# Altium schematic sheet 04 - Auxiliary Power.SchDoc: Auxiliary Power - 25kW WolfPACK FM3 Six-Pack Inv. (part 1 of 3)
size 431 x 279 mm; Date: 07/2023; DocumentNumber: CRD25DA12N-FMC; Revision: 1.1; SheetNumber: 4; SheetTotal: 8; SheetSize: B
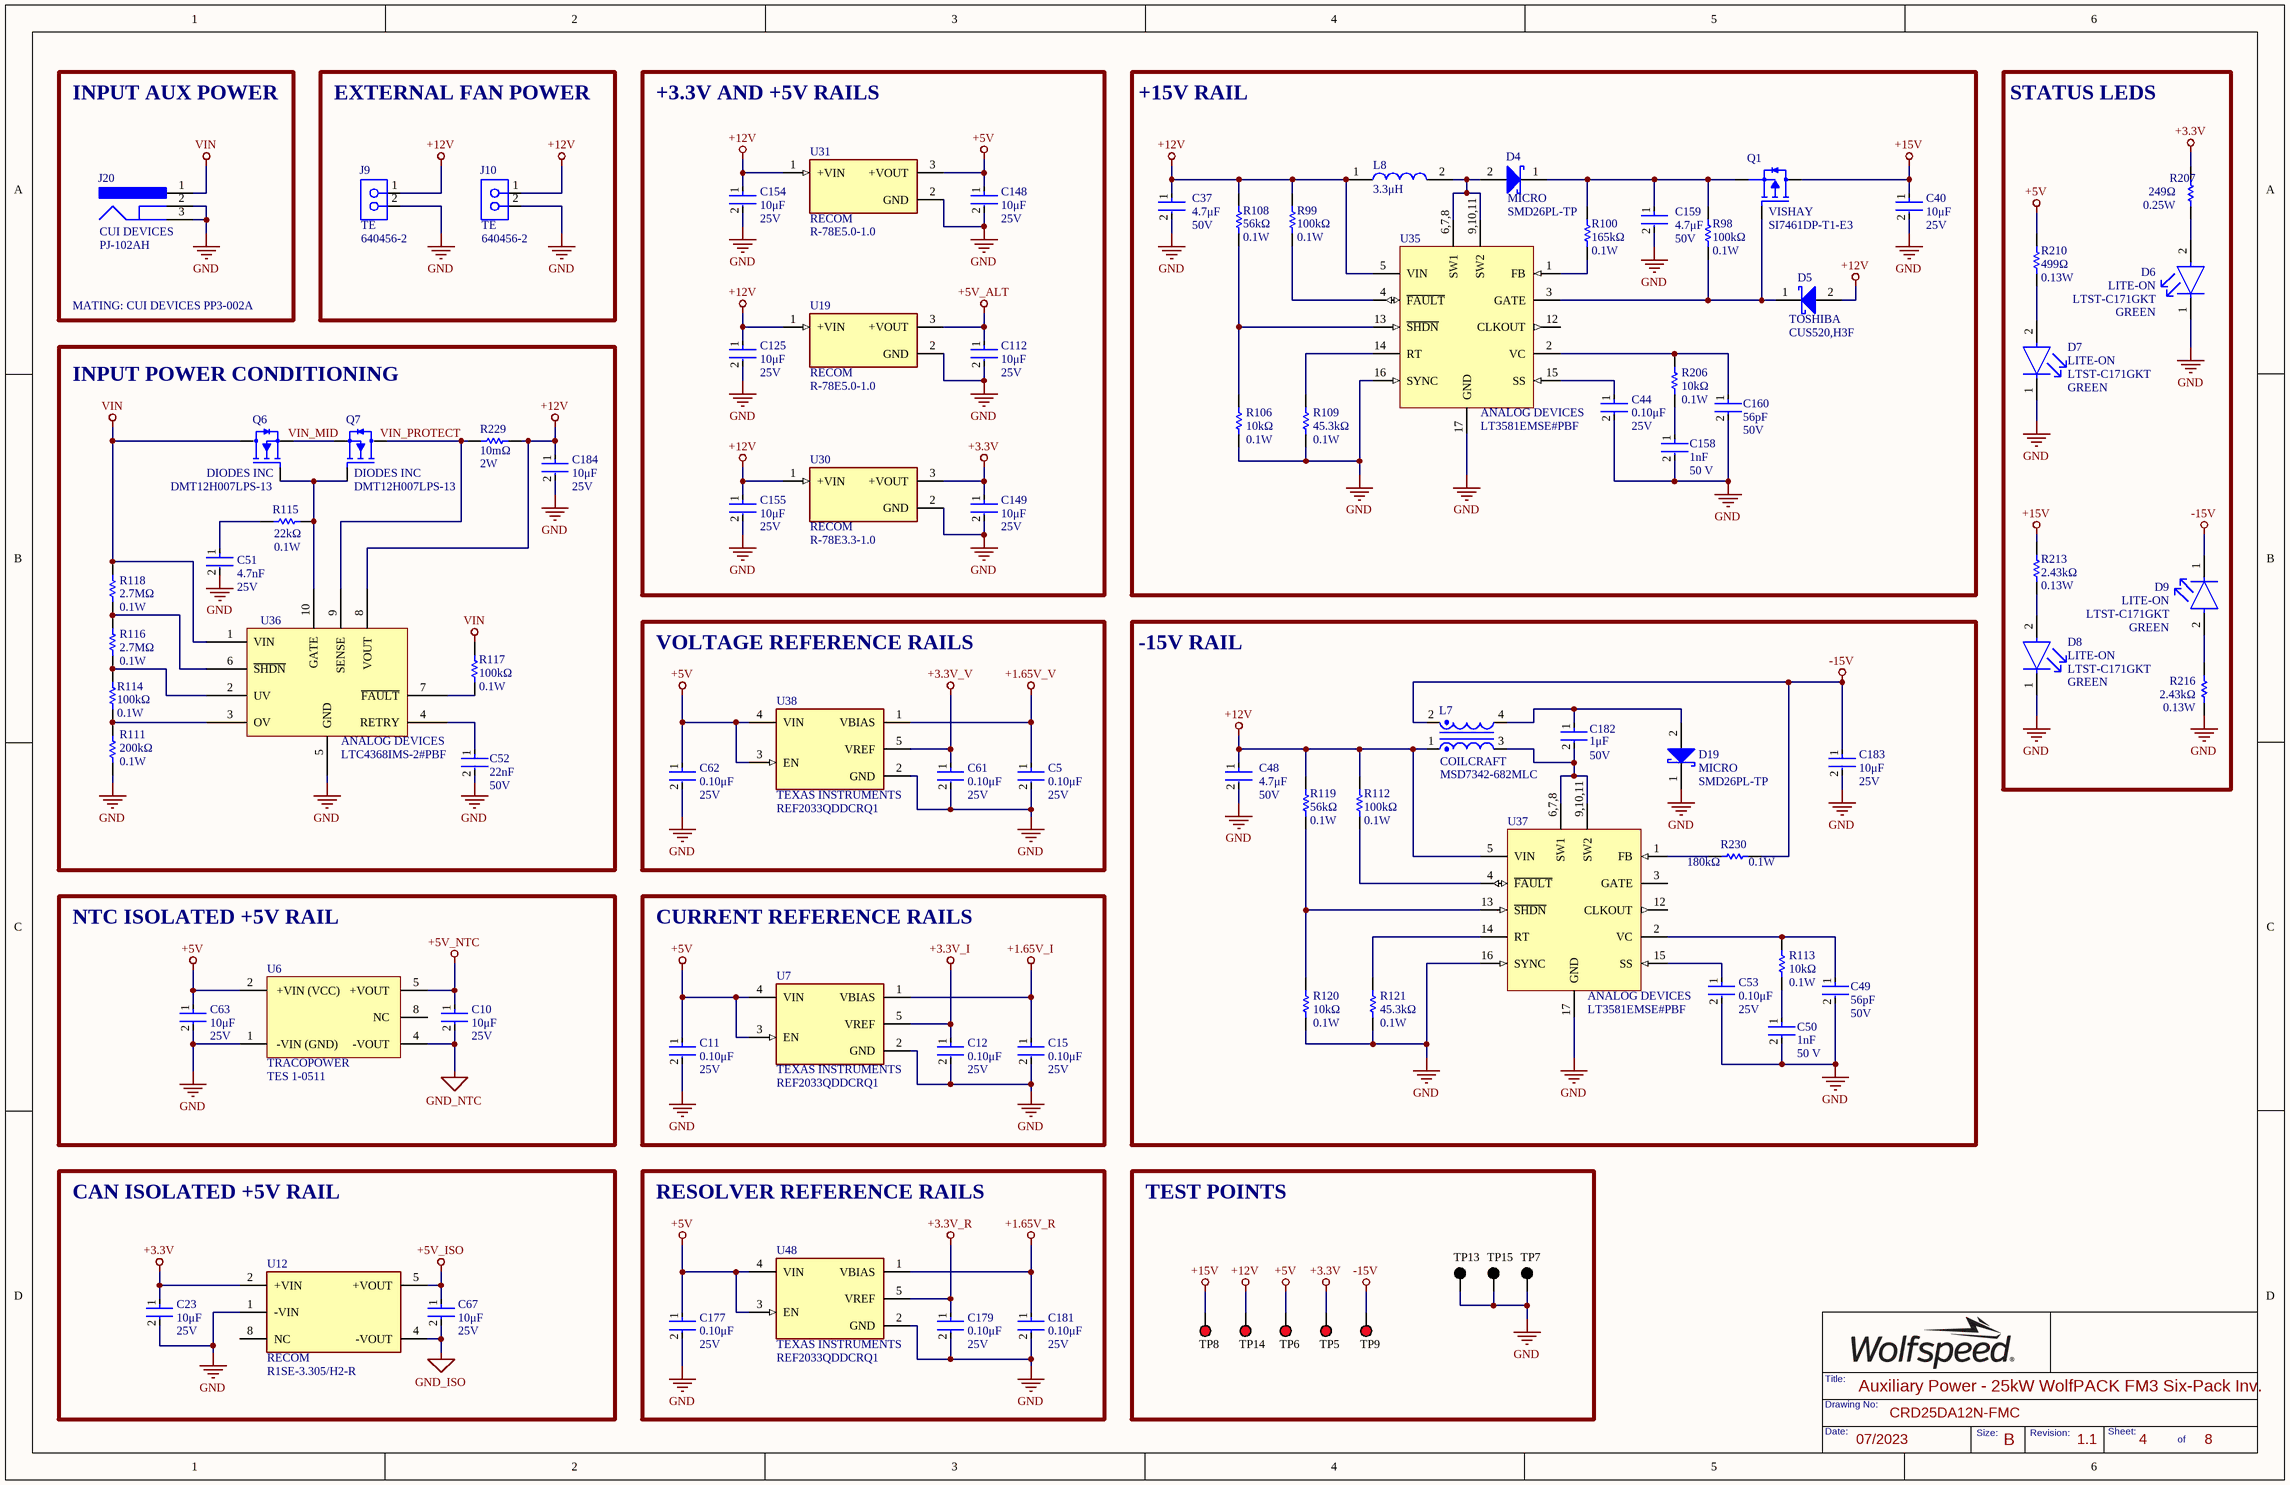
[diagram p0: 04 - Auxiliary Power.SchDoc]

## Parts
C5  Voltage Rating: 25V  Capacitance: 0.10μF  [FP-C0603C-CF-IPC_B]  (hidden comment: C0603C104K3RACTU)
C10  Voltage Rating: 25V  Capacitance: 10μF  [FP-CL31-IPC_B]  (hidden comment: CL31B106KAHSFNE)
C11  Voltage Rating: 25V  Capacitance: 0.10μF  [FP-C0603C-CF-IPC_B]  (hidden comment: C0603C104K3RACTU)
C12  Voltage Rating: 25V  Capacitance: 0.10μF  [FP-C0603C-CF-IPC_B]  (hidden comment: C0603C104K3RACTU)
C15  Voltage Rating: 25V  Capacitance: 0.10μF  [FP-C0603C-CF-IPC_B]  (hidden comment: C0603C104K3RACTU)
C23  Voltage Rating: 25V  Capacitance: 10μF  [FP-CL31-IPC_B]  (hidden comment: CL31B106KAHSFNE)
C37  Voltage Rating: 50V  Capacitance: 4.7μF  [FP-CL31-IPC_C]  (hidden comment: CL31B475KBHNFNE)
C40  Voltage Rating: 25V  Capacitance: 10μF  [FP-CL31-IPC_B]  (hidden comment: CL31B106KAHSFNE)
C44  Voltage Rating: 25V  Capacitance: 0.10μF  [FP-C0603C-CF-IPC_B]  (hidden comment: C0603C104K3RACTU)
C48  Voltage Rating: 50V  Capacitance: 4.7μF  [FP-CL31-IPC_C]  (hidden comment: CL31B475KBHNFNE)
C49  Capacitance: 56pF  Voltage Rating: 50V  [FP-C0603C-CF-IPC_B]  (hidden comment: CL10C560JB8NNNC)
C50  Capacitance: 1nF  Voltage Rating: 50 V  [FP-C0603C-CF-IPC_B]  (hidden comment: C0603C102K5RACAUTO)
C51  Voltage Rating: 25V  Capacitance: 4.7nF  [FP-C0603C-CF-IPC_B]  (hidden comment: C0603C472K3RAC7867)
C52  Capacitance: 22nF  Voltage: 50V  [FP-C0603C-CF-IPC_B]  (hidden comment: CC0805KRX7R9BB223)
C53  Voltage Rating: 25V  Capacitance: 0.10μF  [FP-C0603C-CF-IPC_B]  (hidden comment: C0603C104K3RACTU)
C61  Voltage Rating: 25V  Capacitance: 0.10μF  [FP-C0603C-CF-IPC_B]  (hidden comment: C0603C104K3RACTU)
C62  Voltage Rating: 25V  Capacitance: 0.10μF  [FP-C0603C-CF-IPC_B]  (hidden comment: C0603C104K3RACTU)
C63  Voltage Rating: 25V  Capacitance: 10μF  [FP-CL31-IPC_B]  (hidden comment: CL31B106KAHSFNE)
C67  Voltage Rating: 25V  Capacitance: 10μF  [FP-CL31-IPC_B]  (hidden comment: CL31B106KAHSFNE)
C112  Voltage Rating: 25V  Capacitance: 10μF  [FP-CL31-IPC_B]  (hidden comment: CL31B106KAHSFNE)
C125  Voltage Rating: 25V  Capacitance: 10μF  [FP-CL31-IPC_B]  (hidden comment: CL31B106KAHSFNE)
C148  Voltage Rating: 25V  Capacitance: 10μF  [FP-CL31-IPC_B]  (hidden comment: CL31B106KAHSFNE)
C149  Voltage Rating: 25V  Capacitance: 10μF  [FP-CL31-IPC_B]  (hidden comment: CL31B106KAHSFNE)
C154  Voltage Rating: 25V  Capacitance: 10μF  [FP-CL31-IPC_B]  (hidden comment: CL31B106KAHSFNE)
C155  Voltage Rating: 25V  Capacitance: 10μF  [FP-CL31-IPC_B]  (hidden comment: CL31B106KAHSFNE)
C158  Capacitance: 1nF  Voltage Rating: 50 V  [FP-C0603C-CF-IPC_B]  (hidden comment: C0603C102K5RACAUTO)
C159  Voltage Rating: 50V  Capacitance: 4.7μF  [FP-CL31-IPC_C]  (hidden comment: CL31B475KBHNFNE)
C160  Capacitance: 56pF  Voltage Rating: 50V  [FP-C0603C-CF-IPC_B]  (hidden comment: CL10C560JB8NNNC)
C177  Voltage Rating: 25V  Capacitance: 0.10μF  [FP-C0603C-CF-IPC_B]  (hidden comment: C0603C104K3RACTU)
C179  Voltage Rating: 25V  Capacitance: 0.10μF  [FP-C0603C-CF-IPC_B]  (hidden comment: C0603C104K3RACTU)
C181  Voltage Rating: 25V  Capacitance: 0.10μF  [FP-C0603C-CF-IPC_B]  (hidden comment: C0603C104K3RACTU)
C182  Capacitance: 1μF  Voltage: 50V  [FP-CL21-IPC_A]  (hidden comment: CL21B105KBFNNNE)
C183  Voltage Rating: 25V  Capacitance: 10μF  [FP-CL31-IPC_B]  (hidden comment: CL31B106KAHSFNE)
C184  Voltage Rating: 25V  Capacitance: 10μF  [FP-CL31-IPC_B]  (hidden comment: CL31B106KAHSFNE)
D4  SMD26PL-TP  Manufacturer Print: MICRO  [ONSC-SOD-123FL-2-498-01_V]
D5  CUS520,H3F  Manufacturer Print: TOSHIBA  [FP-USC-MFG]
D6  value GREEN  Manufacturer: LITE-ON  [FP-LTST-C171GKT-MFG]  (hidden comment: LTST-C171GKT)
D7  value GREEN  Manufacturer: LITE-ON  [FP-LTST-C171GKT-MFG]  (hidden comment: LTST-C171GKT)
D8  value GREEN  Manufacturer: LITE-ON  [FP-LTST-C171GKT-MFG]  (hidden comment: LTST-C171GKT)
D9  value GREEN  Manufacturer: LITE-ON  [FP-LTST-C171GKT-MFG]  (hidden comment: LTST-C171GKT)
D19  SMD26PL-TP  Manufacturer Print: MICRO  [ONSC-SOD-123FL-2-498-01_V]
J9  640456-2  Manufacturer Print: TE  [TECO-640456-2_V]
J10  640456-2  Manufacturer Print: TE  [TECO-640456-2_V]
J20  PJ-102AH  Manufacturer Print: CUI DEVICES  [CUI-PJ-102B_V]
L7  MSD7342-682MLC  Manfacturer Print: COILCRAFT  [MSD7342682MLC]
L8  value 3.3μH  [FP-NR5040-H_4_1-MFG]  (hidden comment: NRS5040T3R3NMGJ)
Q1  Manufacturer: VISHAY  [FP-S17-0173-SINGLE-MFG]  (hidden comment: SI7461DP-T1-E3)
Q6  DMT12H007LPS-13  Manufacturer: DIODES INC  [FP-PowerDI5060-8-MFG]
Q7  DMT12H007LPS-13  Manufacturer: DIODES INC  [FP-PowerDI5060-8-MFG]
R98  Resistance: 100kΩ  Power Rating: 0.1W  [FP-MCR03-IPC_B]  (hidden comment: RC0603FR-07100KL)
R99  Resistance: 100kΩ  Power Rating: 0.1W  [FP-MCR03-IPC_B]  (hidden comment: RC0603FR-07100KL)
R100  Resistance: 165kΩ  Power Rating: 0.1W  [FP-MCR03-IPC_B]  (hidden comment: ERJ-3EKF1653V)
R106  Resistance: 10kΩ  Max Power Dissipation: 0.1W  [FP-MCR03-IPC_B]  (hidden comment: ERJ3EKF1002V)
R108  Resistance: 56kΩ  Power Rating: 0.1W  [FP-MCR03-IPC_B]  (hidden comment: RC0603FR-0756KL)
R109  Max Power Dissipation: 0.1W  Resistance: 45.3kΩ  [FP-MCR03-IPC_B]  (hidden comment: RMCF0603FT45K3)
R111  Resistance: 200kΩ  Max Power Dissipation: 0.1W  [FP-MCR03-IPC_B]  (hidden comment: ERJ-3EKF2003V)
R112  Resistance: 100kΩ  Power Rating: 0.1W  [FP-MCR03-IPC_B]  (hidden comment: RC0603FR-07100KL)
R113  Resistance: 10kΩ  Max Power Dissipation: 0.1W  [FP-MCR03-IPC_B]  (hidden comment: ERJ3EKF1002V)
R114  Resistance: 100kΩ  Power Rating: 0.1W  [FP-MCR03-IPC_B]  (hidden comment: RC0603FR-07100KL)
R115  Power Rating: 0.1W  Resistance: 22kΩ  [FP-MCR03-IPC_B]  (hidden comment: ERJ-3EKF2202V)
R116  Power Rating: 0.1W  Resistance: 2.7MΩ  [FP-MCR03-IPC_B]  (hidden comment: RC0603JR-072M7L)
R117  Resistance: 100kΩ  Power Rating: 0.1W  [FP-MCR03-IPC_B]  (hidden comment: RC0603FR-07100KL)
R118  Power Rating: 0.1W  Resistance: 2.7MΩ  [FP-MCR03-IPC_B]  (hidden comment: RC0603JR-072M7L)
R119  Resistance: 56kΩ  Power Rating: 0.1W  [FP-MCR03-IPC_B]  (hidden comment: RC0603FR-0756KL)
R120  Resistance: 10kΩ  Max Power Dissipation: 0.1W  [FP-MCR03-IPC_B]  (hidden comment: ERJ3EKF1002V)
R121  Max Power Dissipation: 0.1W  Resistance: 45.3kΩ  [FP-MCR03-IPC_B]  (hidden comment: RMCF0603FT45K3)
R206  Resistance: 10kΩ  Max Power Dissipation: 0.1W  [FP-MCR03-IPC_B]  (hidden comment: ERJ3EKF1002V)
R207  Resistance: 249Ω  Power Rating: 0.25W  [FP-MCR18-IPC_A]  (hidden comment: RC1206FR-07249RL)
R210  Resistance: 499Ω  Max Power Dissipation: 0.13W  [FP-MCR10-IPC_A]  (hidden comment: RC0805FR-07499RL)
R213  Resistance: 2.43kΩ  Power Rating: 0.13W  [FP-MCR10-IPC_A]  (hidden comment: ERJ-6ENF2431V)
R216  Resistance: 2.43kΩ  Power Rating: 0.13W  [FP-MCR10-IPC_A]  (hidden comment: ERJ-6ENF2431V)
R229  Resistance: 10mΩ  Max Power Dissipation: 2W  [FP-RL2512-IPC_A]  (hidden comment: PE2512FKE7W0R01L)
R230  Resistance: 180kΩ  Max Power Dissipation: 0.1W  [FP-CRGCQ0603-IPC_A]  (hidden comment: CRGCQ0603F180K)
TP5  5010  [KSTN-5010_V]  (value not drawn)
TP6  5010  [KSTN-5010_V]  (value not drawn)
TP7  5011  [KSTN-5011_V]  (value not drawn)
TP8  5010  [KSTN-5010_V]  (value not drawn)
TP9  5010  [KSTN-5010_V]  (value not drawn)
TP13  5011  [KSTN-5011_V]  (value not drawn)
TP14  5010  [KSTN-5010_V]  (value not drawn)
TP15  5011  [KSTN-5011_V]  (value not drawn)
U6  Manufacturer: TRACOPOWER  [TRACO-TES1-5_V]  (hidden comment: TES 1-0511)
U7  Manufacturer: TEXAS INSTRUMENTS  [FP-DDC0005A-MFG]  (hidden comment: REF2033QDDCRQ1)
U12  Manufacturer: RECOM  [FP-R1SE-0505-R-MFG]  (hidden comment: R1SE-3.305/H2-R)
U19  R-78E5.0-1.0  Manufacturer Print: RECOM  [CONV_R-78E5.0-1.0]
U30  R-78E3.3-1.0  Manufacturer Print: RECOM  [CONV_R-78E3.3-1.0]
U31  R-78E5.0-1.0  Manufacturer Print: RECOM  [CONV_R-78E5.0-1.0]
U35  LT3581EMSE#PBF  Manufacturer Print: ANALOG DEVICES  [LT-MSE-16-EDP_L]
U36  LTC4368IMS-2#PBF  Manufacturer Print: ANALOG DEVICES  [SOP50P490X110-10N]
U37  LT3581EMSE#PBF  Manufacturer Print: ANALOG DEVICES  [LT-MSE-16-EDP_L]
U38  Manufacturer: TEXAS INSTRUMENTS  [FP-DDC0005A-MFG]  (hidden comment: REF2033QDDCRQ1)
U48  Manufacturer: TEXAS INSTRUMENTS  [FP-DDC0005A-MFG]  (hidden comment: REF2033QDDCRQ1)

## Blocks framed on the sheet
INPUT AUX POWER: J20
EXTERNAL FAN POWER: J9 J10
+3.3V AND +5V RAILS: C112 C125 C148 C149 C154 C155 U19 U30 U31
+15V RAIL: C37 C40 C44 C158-C160 D4 D5 L8 Q1 R98-R100 R106 R108 R109 R206 U35
STATUS LEDS: D6-D9 R207 R210 R213 R216
INPUT POWER CONDITIONING: C51 C52 C184 Q6 Q7 R111 R114-R118 R229 U36
VOLTAGE REFERENCE RAILS: C5 C61 C62 U38
-15V RAIL: C48-C50 C53 C182 C183 D19 L7 R112 R113 R119-R121 R230 U37
NTC ISOLATED +5V RAIL: C10 C63 U6
CURRENT REFERENCE RAILS: C11 C12 C15 U7
CAN ISOLATED +5V RAIL: C23 C67 U12
RESOLVER REFERENCE RAILS: C177 C179 C181 U48
TEST POINTS: TP5-TP9 TP13-TP15

## Nets
+1.65V_I: C15.1 U7.1(VBIAS)
+1.65V_R: C181.1 U48.1(VBIAS)
+1.65V_V: C5.1 U38.1(VBIAS)
+3.3V: C23.1 C149.1 R207.1 TP5.1 U12.2(+VIN) U30.3(+VOUT)
+3.3V_I: C12.1 U7.5(VREF)
+3.3V_R: C179.1 U48.5(VREF)
+3.3V_V: C61.1 U38.5(VREF)
+5V: C11.1 C62.1 C63.1 C148.1 C177.1 R210.2 TP6.1 U6.2(+VIN_(VCC)) U7.3(EN) U7.4(VIN) U31.3(+VOUT) U38.3(EN) U38.4(VIN) U48.3(EN) U48.4(VIN)
+5V_ALT: C112.1 U19.3(+VOUT)
+5V_ISO: C67.1 U12.5(+VOUT)
+5V_NTC: C10.1 U6.5(+VOUT)
+12V: C37.1 C48.1 C125.1 C154.1 C155.1 C184.1 D5.2(A) J9.1 J10.1 L7.1 L8.1 R99.2 R108.2 R112.2 R119.2 R229.2 TP14.1 U19.1(+VIN) U30.1(+VIN) U31.1(+VIN) U35.5(VIN) U36.8(VOUT) U37.5(VIN)
+15V: C40.1 Q1.5-6-7-8(D) R213.2 TP8.1
-15V: C183.1 D9.1(C) L7.2 R230.2 TP9.1
GND: C5.2 C11.2 C12.2 C15.2 C23.2 C37.2 C40.2 C44.2 C48.2 C49.2 C50.2 C51.2 C52.2 C53.2 C61.2 C62.2 C63.2 C112.2 C125.2 C148.2 C149.2 C154.2 C155.2 C158.2 C159.2 C160.2 C177.2 C179.2 C181.2 C183.2 C184.2 D6.1(C) D7.1(C) D8.1(C) D19.1(K) J9.2 J10.2 J20.2 J20.3 R106.1 R109.1 R111.1 R120.1 R121.1 R216.1 TP7.1 TP13.1 TP15.1 U6.1(-VIN_(GND)) U7.2(GND) U12.1(-VIN) U19.2(GND) U30.2(GND) U31.2(GND) U35.16(SYNC) U35.17(GND) U36.5(GND) U37.16(SYNC) U37.17(GND) U38.2(GND) U48.2(GND)
GND_ISO: C67.2 U12.4(-VOUT)
GND_NTC: C10.2 U6.4(-VOUT)
VIN: J20.1 Q6.5(D) R117.2 R118.2 U36.1(VIN)
VIN_MID: Q6.1,2,3(S) Q7.1,2,3(S)
VIN_PROTECT: Q7.5(D) R229.1 U36.9(SENSE)
NetC44_1: C44.1 U35.15(SS)
NetC49_1: C49.1 R113.2 U37.2(VC)
NetC50_1: C50.1 R113.1
NetC51_1: C51.1 R115.1
NetC52_1: C52.1 U36.4(RETRY)
NetC53_1: C53.1 U37.15(SS)
NetC158_1: C158.1 R206.1
NetC159_1: C159.1 D4.1(K) Q1.1,2,3(S) R98.2 R100.2
NetC160_1: C160.1 R206.2 U35.2(VC)
NetC182_1: C182.1 D19.2(A) L7.4
NetC182_2: C182.2 L7.3 U37.6,7,8(SW1) U37.9,10,11(SW2)
NetD4_2: D4.2(A) L8.2 U35.6,7,8(SW1) U35.9,10,11(SW2)
NetD5_1: D5.1(K) Q1.4(G) R98.1 U35.3(GATE)
NetD6_2: D6.2(A) R207.2
NetD7_2: D7.2(A) R210.1
NetD8_2: D8.2(A) R213.1
NetD9_2: D9.2(A) R216.2
NetQ6_4: Q6.4(G) Q7.4(G) R115.2 U36.10(GATE)
NetR99_1: R99.1 U35.4(~{FAULT})
NetR100_1: R100.1 U35.1(FB)
NetR106_2: R106.2 R108.1 U35.13(~{SHDN})
NetR109_2: R109.2 U35.14(RT)
NetR111_2: R111.2 R114.1 U36.3(OV)
NetR112_1: R112.1 U37.4(~{FAULT})
NetR114_2: R114.2 R116.1 U36.2(UV)
NetR116_2: R116.2 R118.1 U36.6(~{SHDN})
NetR117_1: R117.1 U36.7(~{FAULT})
NetR119_1: R119.1 R120.2 U37.13(~{SHDN})
NetR121_2: R121.2 U37.14(RT)
NetR230_1: R230.1 U37.1(FB)

Not connected (* = marked no-connect by the designer): U6 8(NC); U12 8(NC); U35 12(CLKOUT); U37 3(GATE) 12(CLKOUT)

## Notes on the sheet
- MATING: CUI DEVICES PP3-002A
- Title:
- Date:
- Drawing No:
- Size:
- Revision:
- Sheet:
- of